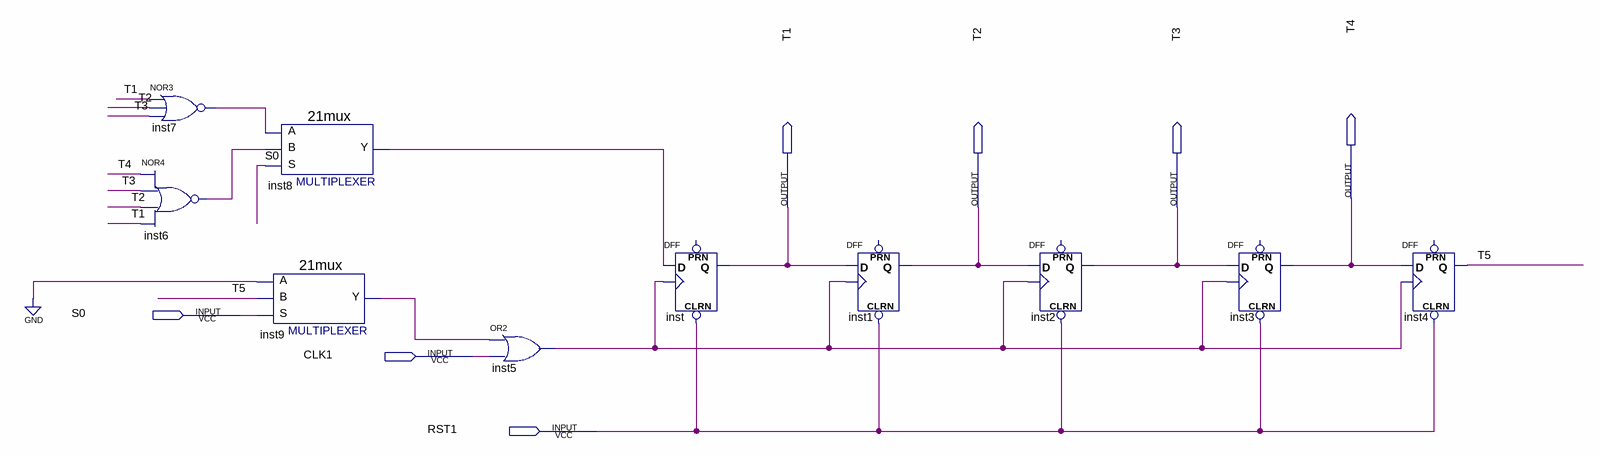
[diagram p0: schematic sheet]
// Quartus schematic step3.bdf as structural Verilog: 10 symbols, 7 pins
module step3 (
  input  S0,
  input  CLK1,
  input  RST1,
  output T4,
  output T1,
  output T2,
  output T3
);

  wire inst5_out, inst6_out, inst7_out, inst8_y, inst9_y, T5;

  nor inst7 (inst7_out, T1, T2, T3);
  nor inst6 (inst6_out, T4, T3, T2, T1);
  \21mux  inst8 (.S(S0), .B(inst6_out), .A(inst7_out), .Y(inst8_y));
  \21mux  inst9 (.S(S0), .B(T5), .A(1'b0), .Y(inst9_y));
  or inst5 (inst5_out, inst9_y, CLK1);
  DFF inst (.CLRN(RST1), .CLK(inst5_out), .D(inst8_y), .Q(T1));  // open: PRN
  DFF inst1 (.CLRN(RST1), .CLK(inst5_out), .D(T1), .Q(T2));  // open: PRN
  DFF inst2 (.CLRN(RST1), .CLK(inst5_out), .D(T2), .Q(T3));  // open: PRN
  DFF inst3 (.CLRN(RST1), .CLK(inst5_out), .D(T3), .Q(T4));  // open: PRN
  DFF inst4 (.CLRN(RST1), .CLK(inst5_out), .D(T4), .Q(T5));  // open: PRN
endmodule
